# EAGLE design MYATxmega32 (EAGLE 8.4.0)
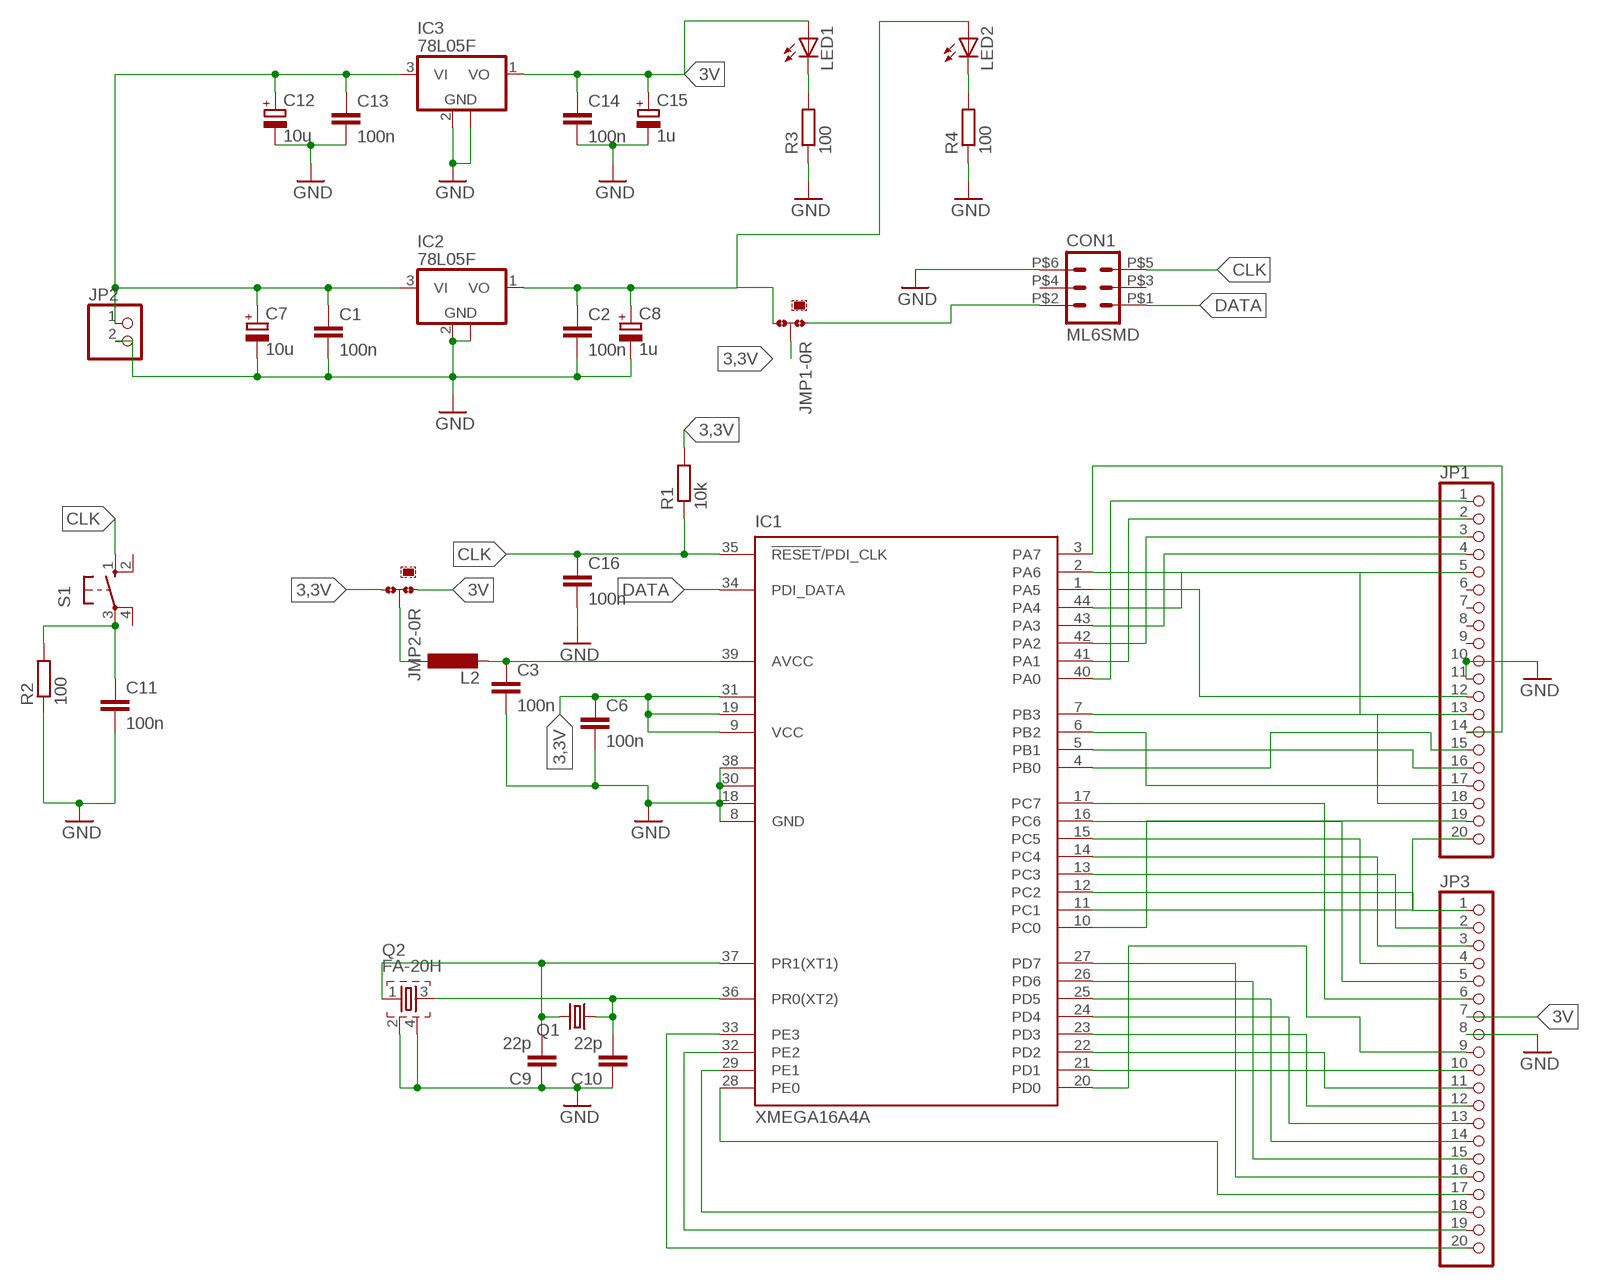
[diagram p0: schematic, sheet 1]

## Parts
C1  100n  C-EUC0805K  [C0805K]
C2  100n  C-EUC0805K  [C0805K]
C3  100n  C-EUC0805K  [C0805K]
C6  100n  C-EUC0805K  [C0805K]
C7  10u  CPOL-EUE2-5  [E2-5]
C8  1u  CPOL-EU153CLV-0405  [153CLV-0405]
C9  22p  C-EUC0805K  [C0805K]
C10  22p  C-EUC0805K  [C0805K]
C11  100n  C-EUC0805K  [C0805K]
C12  10u  CPOL-EUE2-5  [E2-5]
C13  100n  C-EUC0805K  [C0805K]
C14  100n  C-EUC0805K  [C0805K]
C15  1u  CPOL-EU153CLV-0405  [153CLV-0405]
C16  100n  C-EUC0805K  [C0805K]
CON1  ML6SMD  [CON06]
IC1  XMEGA16A4A  [TQFP44]
IC2  78L05F  [SOT89]
IC3  78L05F  [SOT89]
JMP1  0R-JUMPA  [A0R-JMP]
JMP2  0R-JUMPA  [A0R-JMP]
JP1  PINHD-1X20  [1X20]
JP2  PINHD-1X2  [1X02]
JP3  PINHD-1X20  [1X20]
L2  L-EU0207/7  [0207/7]
LED1  LEDSML0805  [SML0805]
LED2  LEDSML0805  [SML0805]
Q1  CRYSTALHC18U-V  [HC18U-V]
Q2  FA-20H  [FA-20H]
R1  10k  R-EU_R0805  [R0805]
R2  100  R-EU_R0805  [R0805]
R3  100  R-EU_R0805  [R0805]
R4  100  R-EU_R0805  [R0805]
S1  10-XX  [B3F-10XX]

## Nets
3,3V: C6.1 IC1.9(VCC) IC1.19(VCC1) IC1.31(VCC2) JMP1.2 JMP2.3 R1.2
3V: C14.1 C15.+ IC3.1(VO) JMP2.1 JP3.7 LED1.A
CLK: C16.1 CON1.P$5 IC1.35(!RESET!/PDI_CLK) R1.1 S1.1(S)
DATA: CON1.P$1 IC1.34(PDI_DATA)
GND: C1.2 C2.2 C3.2 C6.2 C7.- C8.- C9.1 C10.1 C11.2 C12.- C13.2 C14.2 C15.- C16.2 CON1.P$6 IC1.8(GND) IC1.18(GND1) IC1.30(GND2) IC1.38(GND3) IC2.2(GND) IC2.2@1(GND) IC3.2(GND) IC3.2@1(GND) JP1.10 JP1.11 JP2.2 JP3.8 Q2.2 Q2.4 R2.1 R3.1 R4.1
N$1: C2.1 C8.+ IC2.1(VO) JMP1.3 LED2.A
N$2: C1.1 C7.+ C12.+ C13.1 IC2.3(VI) IC3.3(VI) JP2.1
N$3: JMP2.2 L2.1
N$4: C9.2 IC1.37(PR1(XT1)) Q1.2 Q2.1
N$5: C11.1 R2.2 S1.3(P)
N$6: C3.1 IC1.39(AVCC) L2.2
N$7: IC1.3(PA7) JP1.14
N$8: IC1.12(PC2) JP3.1
N$9: IC1.2(PA6) JP1.13
N$10: CON1.P$2 JMP1.1
N$11: IC1.44(PA4) JP1.5
N$12: IC1.43(PA3) JP1.4
N$13: IC1.42(PA2) JP1.3
N$14: IC1.41(PA1) JP1.2
N$15: IC1.13(PC3) JP3.2
N$16: IC1.4(PB0) JP1.15
N$17: IC1.5(PB1) JP1.16
N$18: IC1.6(PB2) JP1.17
N$19: IC1.7(PB3) JP1.18
N$20: IC1.40(PA0) JP1.1
N$21: LED1.C R3.2
N$22: C10.2 IC1.36(PR0(XT2)) Q1.1 Q2.3
N$23: IC1.14(PC4) JP3.3
N$24: IC1.15(PC5) JP3.4
N$25: IC1.16(PC6) JP3.5
N$26: IC1.17(PC7) JP3.6
N$27: IC1.1(PA5) JP1.12
N$28: LED2.C R4.2
N$29: IC1.21(PD1) JP3.10
N$30: IC1.20(PD0) JP3.9
N$31: IC1.22(PD2) JP3.11
N$32: IC1.23(PD3) JP3.12
N$33: IC1.24(PD4) JP3.13
N$34: IC1.25(PD5) JP3.14
N$35: IC1.26(PD6) JP3.15
N$36: IC1.27(PD7) JP3.16
N$37: IC1.28(PE0) JP3.17
N$38: IC1.29(PE1) JP3.18
N$39: IC1.32(PE2) JP3.19
N$40: IC1.33(PE3) JP3.20
N$41: IC1.10(PC0) JP1.19
N$42: IC1.11(PC1) JP1.20
Unconnected: CON1.P$3 CON1.P$4 JP1.6 JP1.7 JP1.8 JP1.9 S1.2(S1) S1.4(P1)

## Library data of the parts
C1-C3 C6 C9-C11 C13 C14 C16 = resistor:C-EU: CAPACITOR, European symbol
C7 C8 C12 C15 = resistor:CPOL-EU: POLARIZED CAPACITOR, European symbol
CON1 = con_harting-smd:ML6SMD; SPICEPREFIX: X
IC1 = atmel:XMEGA16A4: MICROCONTROLLER Features High-performance, Low-power 8/16-bit AVR XMEGA Microcontroller Non-Volatile Program and Data Memories - 16 KB - 128 KB of In-System Self-Programmable Flash - 4 KB - 8 KB Boot Code Section with Independent Lock Bits - 1 KB - 2 KB EEPROM - 2 KB - 8 KB Internal SRAM Peripheral Features - Four-channel DMA Controller with support for external requests - Eight-channel Event System - Five 16-bit Timer/Counters Three Timer/Counters with 4 Output Compare or Input Capture channels Two Timer/Counters with 2 Output Compare or Input Capture channels High-Resolution Extensions on all Timer/Counters Advanced Waveform Extension on one Timer/Counter - Five USARTs IrDA Extension on one USART - Two Two-Wire Interfaces with dual address match (I2C and SMBus compatible) - Two SPIs (Serial Peripheral Interfaces) peripherals - AES and DES Crypto Engine - 16-bit Real Time Counter with Separate Oscillator - One Twelve-channel, 12-bit, 2 Msps Analog to Digital Converter - One Two-channel, 12-bit, 1 Msps Digital to Analog Converter - Two Analog Comparators with Window compare function - External Interrupts on all General Purpose I/O pins - Programmable Watchdog Timer with Separate On-chip Ultra Low Power Oscillator Special Microcontroller Features - Power-on Reset and Programmable Brown-out Detection - Internal and External Clock Options with PLL - Programmable Multi-level Interrupt Controller - Sleep Modes: Idle, Power-down, Standby, Power-save, Extended Standby - Advanced Programming, Test and Debugging Interfaces PDI (Program and Debug Interface) for programming, test and debugging I/O and Packages - 34 Programmable I/O Lines - 44 - lead TQFP - 44 - pad VQFN/QFN - 49 - ball VFBGA Operating Voltage - 1.6 - 3.6V Speed performance - 0 - 12 MHz @ 1.6 - 3.6V - 0 - 32 MHz @ 2.7 - 3.6V Drawn by Dipl.-Ing. (FH) Robert Siegler Created: 27.05.09; OC_FARNELL: unknown; OC_NEWARK: unknown
IC2 IC3 = linear:78L*: POSITOIV-VOLTAGE REGULATORS Output up to 100 mA Source: Datasheet <http://focus.ti.com/lit/ds/symlink/ua78l05.pdf>
JMP1 JMP2 = jump-0r-smd:0R-JUMP: SMD 0R 0805 Jumper
JP1 JP3 = pinhead:PINHD-1X20: PIN HEADER
JP2 = pinhead:PINHD-1X2: PIN HEADER
L2 = resistor:L-EU: INDUCTOR, European symbol
LED1 LED2 = led:LED: LED OSRAM: - CHIPLED LG R971, LG N971, LY N971, LG Q971, LY Q971, LO R971, LY R971 LH N974, LH R974 LS Q976, LO Q976, LY Q976 LO Q996 - Hyper CHIPLED LW Q18S LB Q993, LB Q99A, LB R99A - SideLED LS A670, LO A670, LY A670, LG A670, LP A670 LB A673, LV A673, LT A673, LW A673 LH A674 LY A675 LS A676, LA A676, LO A676, LY A676, LW A676 LS A679, LY A679, LG A679 - Hyper Micro SIDELED® LS Y876, LA Y876, LO Y876, LY Y876 LT Y87S - SmartLED LW L88C, LW L88S LB L89C, LB L89S, LG L890 LS L89K, LO L89K, LY L89K LS L896, LA L896, LO L896, LY L896 - TOPLED LS T670, LO T670, LY T670, LG T670, LP T670 LSG T670, LSP T670, LSY T670, LOP T670, LYG T670 LG T671, LOG T671, LSG T671 LB T673, LV T673, LT T673, LW T673 LH T674 LS T676, LA T676, LO T676, LY T676, LB T676, LH T676, LSB T676, LW T676 LB T67C, LV T67C, LT T67C, LS T67K, LO T67K, LY T67K, LW E67C LS E67B, LA E67B, LO E67B, LY E67B, LB E67C, LV E67C, LT E67C LW T67C LS T679, LY T679, LG T679 LS T770, LO T770, LY T770, LG T770, LP T770 LB T773, LV T773, LT T773, LW T773 LH T774 LS E675, LA E675, LY E675, LS T675 LS T776, LA T776, LO T776, LY T776, LB T776 LHGB T686 LT T68C, LB T68C - Hyper Mini TOPLED® LB M676 - Mini TOPLED Santana® LG M470 LS M47K, LO M47K, LY M47K Source: http://www.osram.convergy.de LUXEON: - LUMILED® LXK2-PW12-R00, LXK2-PW12-S00, LXK2-PW14-U00, LXK2-PW14-V00 LXK2-PM12-R00, LXK2-PM12-S00, LXK2-PM14-U00 LXK2-PE12-Q00, LXK2-PE12-R00, LXK2-PE12-S00, LXK2-PE14-T00, LXK2-PE14-U00 LXK2-PB12-K00, LXK2-PB12-L00, LXK2-PB12-M00, LXK2-PB14-N00, LXK2-PB14-P00, LXK2-PB14-Q00 LXK2-PR12-L00, LXK2-PR12-M00, LXK2-PR14-Q00, LXK2-PR14-R00 LXK2-PD12-Q00, LXK2-PD12-R00, LXK2-PD12-S00 LXK2-PH12-R00, LXK2-PH12-S00 LXK2-PL12-P00, LXK2-PL12-Q00, LXK2-PL12-R00 Source: www.luxeon.com KINGBRIGHT: KA-3528ASYC Source: www.kingbright.com
Q1 = crystal:CRYSTAL: CRYSTAL; OC_FARNELL: unknown; OC_NEWARK: unknown
Q2 = crystal:FA-: MHz RANGE CRYSTAL UNIT Source: Epson Toyocom
R1-R4 = resistor:R-EU_: RESISTOR, European symbol
S1 = switch-omron:10-XX: OMRON SWITCH; MPN: B3F-1000; OC_FARNELL: 176432; OC_NEWARK: 36M3542

## Board
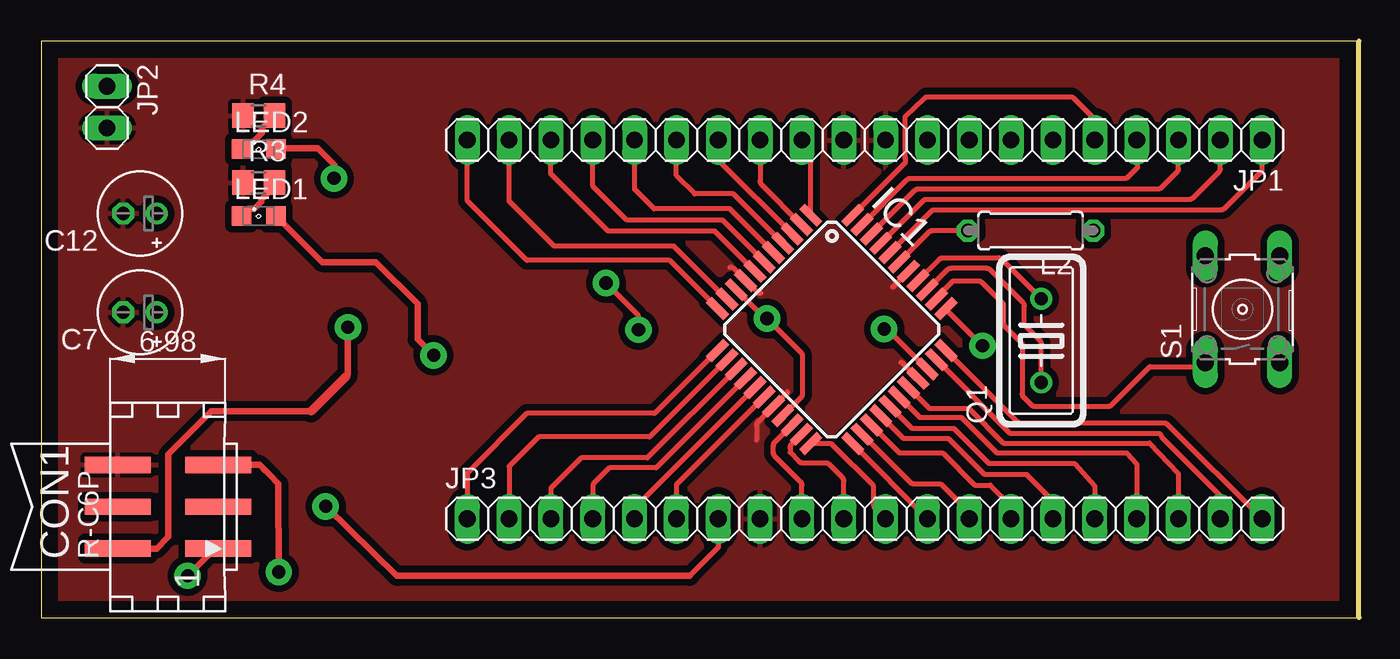
[diagram p1: board, top side]
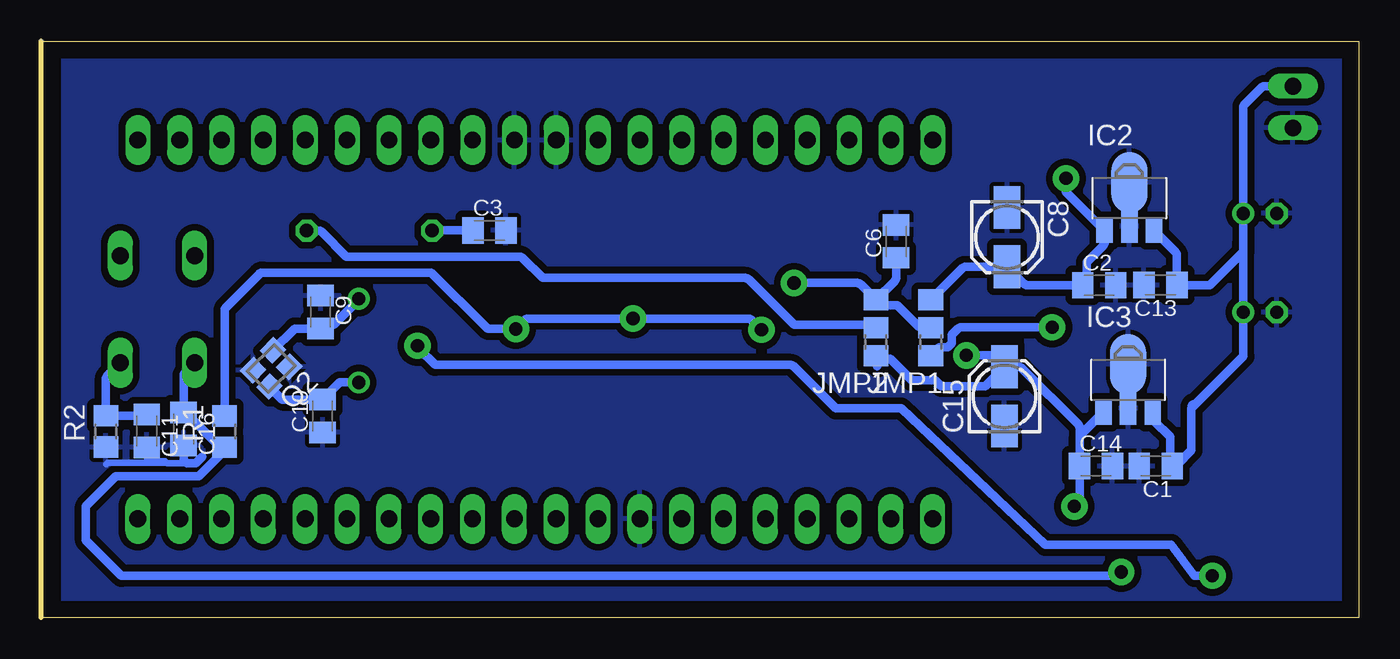
[diagram p2: board, bottom side, seen from below]

Size 80 x 35 mm. Coordinates in mm from the lower left corner, seen from the top.
Outline: 0,0 80,0 80,35 0,35 0,0
Copper layers (1*16): Top 0.035mm / dielectric 1.5mm / Bottom 0.035mm
Design rules "default": minimum track width 6mil, minimum drill 0.35mm, track to track 6mil, track to pad 6mil, pad to pad 6mil, via to via 6mil, smd to smd 6mil, copper to edge 40mil, drill to drill 6mil, minimum pad ring 10mil, minimum via ring 8mil, stop-mask expansion 4mil, vias tented up to drill 0mil, thermal gap 10mil

### Footprints (pad centres in the part's own frame; a part is rotated, then mirrored left to right if it is on the bottom)
C0805K = smd 1.3 x 1.6: 1 -1,0; 2 1,0
E2-5 = drill 0.813 pad 1.27: + -1.016,0 | drill 0.813 pad 1.27 octagon: - 1.016,0
153CLV-0405 = smd 2.6 x 1.6: + 1.8,0; - -1.8,0
CON06 = smd 1 x 4: P$1 -2.54,-3.048; P$2 -2.54,3.048; P$3 0,-3.048; P$4 0,3.048; P$5 2.54,-3.048; P$6 2.54,3.048
TQFP44 = smd 1.5 x 0.5: 1 -5.8,4; 2 -5.8,3.2; 3 -5.8,2.4; 4 -5.8,1.6; 5 -5.8,0.8; 6 -5.8,0; 7 -5.8,-0.8; 8 -5.8,-1.6; 9 -5.8,-2.4; 10 -5.8,-3.2; 11 -5.8,-4; 23 5.8,-4; 24 5.8,-3.2; 25 5.8,-2.4; 26 5.8,-1.6; 27 5.8,-0.8; 28 5.8,0; 29 5.8,0.8; 30 5.8,1.6; 31 5.8,2.4; 32 5.8,3.2; 33 5.8,4 | smd 0.5 x 1.5: 12 -4,-5.8; 13 -3.2,-5.8; 14 -2.4,-5.8; 15 -1.6,-5.8; 16 -0.8,-5.8; 17 0,-5.8; 18 0.8,-5.8; 19 1.6,-5.8; 20 2.4,-5.8; 21 3.2,-5.8; 22 4,-5.8; 34 4,5.8; 35 3.2,5.8; 36 2.4,5.8; 37 1.6,5.8; 38 0.8,5.8; 39 0,5.8; 40 -0.8,5.8; 41 -1.6,5.8; 42 -2.4,5.8; 43 -3.2,5.8; 44 -4,5.8
SOT89 = smd 1 x 1.5: 1 -1.499,-1.981; 3 1.499,-1.981 | smd 1 x 2: 2 0,-1.727 | smd 2.2 x 3.7: 2@1 0,0.94
A0R-JMP = smd 1.5 x 1.3: 1 0,1.7; 2 0,0; 3 0,-1.7
1X20 = drill 1.016 long: 1 -24.13,0; 2 -21.59,0; 3 -19.05,0; 4 -16.51,0; 5 -13.97,0; 6 -11.43,0; 7 -8.89,0; 8 -6.35,0; 9 -3.81,0; 10 -1.27,0; 11 1.27,0; 12 3.81,0; 13 6.35,0; 14 8.89,0; 15 11.43,0; 16 13.97,0; 17 16.51,0; 18 19.05,0; 19 21.59,0; 20 24.13,0
1X02 = drill 1.016 long: 1 -1.27,0; 2 1.27,0
0207/7 = drill 0.813 octagon: 1 -3.81,0; 2 3.81,0
SML0805 = smd 1.2 x 1.2: A 1.05,0; C -1.05,0
HC18U-V = drill 0.813: 1 -2.54,0; 2 2.54,0
FA-20H = smd 1.2 x 1.1: 1 -0.85,-0.7; 2 0.85,-0.7; 3 0.85,0.7; 4 -0.85,0.7
R0805 = smd 1.3 x 1.5: 1 -0.95,0; 2 0.95,0
B3F-10XX = drill 1.016 long: 1 -3.251,2.261; 2 3.251,2.261; 3 -3.251,-2.261; 4 3.251,-2.261

### Placement (x,y rotation side)
C1  12.33,9.2 180 bottom
C2  15.76,20.18 0 bottom
C3  52.78,23.51 0 bottom
C6  28.09,22.85 90 bottom
C7  6,18.54 180 top
C8  21.36,23.1 270 bottom
C9  63.04,18.55 270 bottom
C10  62.92,12.24 90 bottom
C11  73.59,11.33 270 bottom
C12  6,24.54 180 top
C13  12.05,20.19 180 bottom
C14  15.96,9.21 0 bottom
C15  21.51,13.44 90 bottom
C16  71.35,11.45 270 bottom
CON1  7.7,6.73 90 top
IC1  48,17.5 315 top
IC2  13.93,25.48 0 bottom
IC3  14.01,14.45 0 bottom
JMP1  25.99,17.6 180 bottom
JMP2  29.32,17.6 180 bottom
JP1  50,29 180 top
JP2  4,31 270 top
JP3  50,6 0 top
L2  60.07,23.5 180 top
LED1  13.21,24.38 0 top
LED2  13.21,28.45 0 top
Q1  60.72,16.82 90 top
Q2  66.04,15.13 225 bottom
R1  68.86,11.3 90 bottom
R2  76.07,11.31 90 bottom
R3  13.21,26.42 0 top
R4  13.21,30.48 0 top
S1  72.94,18.73 90 top

### Tracks (layer width: path | path; a pad name or v marks a point on that pad's centre or on a via)
3,3V  (via drill 0.8 pad 1.6)
  Top 0.305: IC1.9 43.86,18.25 arc45 v44.07,18.16 46.13,16.09 arc-45 46.23,15.87 46.23,13.6 arc-45 46.13,13.37 IC1.19 | IC1.31 51.46,17.43 arc45 51.24,17.53 v51.18,17.53 | v34.29,20.32 36.18,18.43 arc-45 36.27,18.21 v36.27,17.48
  Bottom 0.508: JMP1.2 26.51,17.6 arc45 26.73,17.69 28.02,18.97 28.86,18.97 arc45 29.09,19.07 JMP2.3 | JMP2.3 28.18,20.44 arc-45 28.09,20.66 C6.1 | R1.2 68.86,18.63 arc45 68.77,18.86 66.77,20.86 arc45 66.54,20.95 56.31,20.95 52.98,17.62 arc-45 52.75,17.53 v51.18,17.53 50.64,18.07 arc45 50.41,18.16 v44.07,18.16 37.09,18.16 arc45 36.86,18.07 v36.27,17.48 | JMP2.3 30.25,20.23 arc-45 30.47,20.32 v34.29,20.32
3V  (via drill 0.8 pad 1.6)
  Top 0.305: JP3.7 41.11,4.28 39.37,2.54
  Top 0.406: v23.82,15.93 22.86,16.89 22.86,19.05 20.32,21.59 17.05,21.59 LED1.A | v17.27,6.76 21.59,2.54 39.37,2.54
  Bottom 0.508: C14.1 arc-45 16.94,9.24 16.94,10.9 arc45 16.85,11.13 IC3.1 | C15.+ 20.68,15.23 arc45 20.45,15.14 17.05,11.74 arc45 16.96,11.52 C14.1 | C15.+ 22.68,14.06 25.34,14.06 25.7,14.43 27.15,14.43 28.45,15.72 29.22,15.72 29.32,15.82 | 29.23,15.26 arc45 29.32,15.48 29.32,15.82 | 29.32,15.82 JMP2.1 | v23.82,15.93 22.2,15.93 C15.+ | v17.27,6.76 16.96,7.17 C14.1
CLK  (via drill 0.8 pad 1.6)
  Top 0.305: IC1.35 arc-45 54.44,19.51 55.37,20.45 56.89,20.45 arc-45 57.12,20.35 58.42,19.05 58.42,17.91 arc45 58.51,17.69 59.56,16.64 59.56,13.59 arc45 59.66,13.37 60.1,12.92 arc45 60.33,12.83 64.77,12.83 arc45 64.99,12.92 67.31,15.24 70.31,15.24 arc45 70.53,15.33 S1.1
  Top 0.406: 13.51,9.02 13.8,8.72 | 13.8,8.72 14.4,8.13 v14.43,2.77 | 13.8,8.72 13.26,9.27 CON1.P$5
  Bottom 0.508: S1.1 71.26,14.89 arc-45 71.35,14.67 C16.1 arc-45 71.13,12.36 69.21,10.44 arc-45 68.98,10.35 R1.1 68.86,10.15 70.43,8.59 75.46,8.59 77.29,6.76 77.29,4.7 75.13,2.54 14.53,2.54 v14.43,2.77
DATA  (via drill 0.8 pad 1.6)
  Top 0.305: v57.15,16.51 54.96,18.7 arc-45 IC1.34
  Top 0.406: v8.89,2.54 10.54,4.19 CON1.P$1
  Bottom 0.508: v57.15,16.51 arc-45 57.08,16.34 56.08,15.34 34.52,15.34 arc45 34.3,15.25 31.75,12.7 27.79,12.7 19.02,4.42 11.38,4.42 9.98,2.54 v8.89,2.54
GND
  Top 0.305: 43.43,10.79 43.43,11.67 arc-45 43.53,11.9 IC1.18 45.31,13.68 45.31,13.72 | IC1.38 51.7,20.07 arc-45 51.69,20.07 | IC1.30 52.32,15.44 arc45 52.2,15.49 | 41.81,21.26 41.98,21.26 IC1.8 43.53,19.71 43.71,19.71
  Bottom 0.406: 73.56,10.3 73.56,9.5 72.47,9.5 | 72.47,9.5 72.36,9.4 75.97,9.4 76.05,9.32 | 72.47,9.5 72.34,9.37 71.12,9.37
  Bottom 0.508: C16.2 71.35,9.55 71.17,9.37 71.12,9.37 70.61,9.37 70.21,9.78 | C11.2 73.56,10.3
  pour Top (isolate 0.406): 79.4,34.5 79.4,0.5 0.6,0.5 0.6,34.4
  pour Bottom (isolate 0.406): 0.9,34 79,34 79,1 0.8,1 0.8,34
N$1  (via drill 0.8 pad 1.6)
  Top 0.406: LED2.A 14.31,28.5 16.79,28.5 17.78,27.51 v17.78,26.67
  Bottom 0.508: JMP1.3 24.08,21.21 arc45 23.86,21.3 C8.+ 20.34,20.28 arc-45 20.11,20.18 C2.1 16.6,20.34 arc-45 16.51,20.57 16.51,21.59 15.52,22.58 arc-45 15.43,22.8 IC2.1 17.78,25.85 v17.78,26.67
N$2
  Bottom 0.508: JP2.1 5.7,32.27 arc-45 5.92,32.18 6.92,31.18 arc-45 7.02,30.95 C12.+ 7.02,22.86 | IC2.3 11.14,22.21 arc45 11.05,21.98 C13.1 9.04,20.19 7.02,22.22 7.02,22.86 | 10.07,12.95 arc-45 10.16,12.72 | 10.16,12.72 10.16,10.16 11.03,9.29 arc45 11.25,9.2 C1.1 11.36,9.23 arc45 11.46,9.46 11.46,10.97 12.42,11.94 arc45 12.51,12.16 IC3.3 | 10.16,12.72 7.02,15.87 C7.+ 7.02,22.86
N$3
  Bottom 0.508: JMP2.2 29.41,17.69 arc-45 29.63,17.78 34.29,17.78 37.04,20.53 arc-45 37.27,20.62 49.55,20.62 50.76,21.83 arc-45 50.98,21.92 61.47,21.92 62.95,23.4 arc-45 63.17,23.5 L2.1
N$4
  Top 0.305: Q1.2 58.33,21.75 arc45 58.11,21.84 54.74,21.84 arc45 54.52,21.75 IC1.37
  Bottom 0.508: Q2.1 64.61,17.55 C9.2 62.81,17.78 62.23,17.78 60.72,19.29 Q1.2
N$5
  Bottom 0.508: C11.1 arc45 73.78,12.26 R2.2 76.07,14.47 arc45 75.98,14.7 S1.3
N$6
  Top 0.305: L2.2 54.13,23.5 arc45 53.9,23.4 IC1.39
  Bottom 0.508: L2.2 arc45 56.22,23.51 C3.1
N$7
  Top 0.305: JP1.14 41.11,27.92 arc45 41.2,27.69 IC1.3
N$8
  Top 0.305: IC1.12 37.24,12.39 29.49,12.39 25.87,8.78 JP3.1
N$9
  Top 0.305: JP1.13 43.65,26.51 arc45 43.74,26.28 IC1.2
N$10  (via drill 0.8 pad 1.6)
  Top 0.406: 18.52,14.66 arc45 18.62,14.89 v18.62,17.63 | 16.38,12.52 10.34,12.52 7.72,9.91 7.72,4.9 7.01,4.19 CON1.P$2
  Top 0.508: 16.38,12.52 18.52,14.66
  Bottom 0.508: 25.87,15.95 arc-45 JMP1.1 25.48,16.41 24.97,16.41 24.71,16.66 24.71,17.17 24.36,17.53 24.36,17.54 arc45 24.13,17.63 v18.62,17.63
N$11
  Top 0.305: 52.48,27.84 52.48,27.94 | 52.48,27.94 52.48,30.45 53.63,31.53 arc-45 53.85,31.62 62.48,31.62 arc-45 62.7,31.53 63.88,30.36 arc-45 63.97,30.13 JP1.5 | 52.48,27.94 52.48,27.63 IC1.44
N$12
  Top 0.305: JP1.4 arc-45 66.55,28.91 66.55,27.3 66.01,26.76 arc-45 65.78,26.67 52.78,26.67 arc45 52.55,26.58 IC1.43
N$13
  Top 0.305: IC1.42 53.05,25.94 arc-45 53.27,26.04 67.81,26.04 arc45 68.04,26.13 68.96,27.05 arc45 69.05,27.27 JP1.3
N$14
  Top 0.305: IC1.41 53.54,25.31 arc-45 53.77,25.4 69.72,25.4 arc45 69.94,25.49 71.5,27.05 arc45 71.59,27.27 JP1.2
N$15
  Top 0.305: IC1.13 36.95,10.97 30.2,10.97 28.41,9.18 JP3.2
N$16
  Top 0.305: IC1.4 42.03,25.73 39.67,25.73 38.57,26.84 JP1.15
N$17
  Top 0.305: IC1.5 41.82,24.82 37.21,24.82 36.03,26 JP1.16
N$18
  Top 0.305: IC1.6 41.37,24.13 35.56,24.13 33.49,26.2 JP1.17
N$19
  Top 0.305: IC1.7 40.9,23.47 34.42,23.47 30.95,26.94 JP1.18
N$20
  Top 0.305: IC1.40 54.04,24.67 arc-45 54.27,24.77 71.62,24.77 arc45 71.85,24.86 74.04,27.05 arc45 74.13,27.27 JP1.1
N$21
  Top 0.406: LED1.C 12.16,24.42 12.56,24.82 12.93,24.82 13.36,25.25 13.36,25.38 14.16,26.17 R3.2
N$22
  Top 0.305: Q1.1 60.72,16.62 arc45 60.63,16.84 59.69,17.78 59.69,18.92 arc45 59.6,19.14 57.62,21.12 arc45 57.4,21.21 55.23,21.21 arc45 55.01,21.12 IC1.36
  Bottom 0.508: Q2.3 65.35,13.24 C10.2 61.88,14.28 Q1.1
N$23
  Top 0.305: IC1.14 36.81,9.7 32.79,9.7 30.95,7.86 JP3.3
N$24
  Top 0.305: IC1.15 37.33,9.09 34.49,9.09 33.49,8.09 JP3.4
N$25
  Top 0.305: IC1.16 36.12,6.75 arc45 36.03,6.53 JP3.5
N$26
  Top 0.305: IC1.17 38.57,8.07 JP3.6
N$27
  Top 0.305: IC1.1 46.73,28.33 arc45 46.63,28.56 JP1.12
N$28
  Top 0.406: LED2.C 12.16,28.48 12.45,28.48 13.39,29.41 13.39,29.71 R4.2
N$29
  Top 0.305: IC1.21 45.56,10.53 arc45 45.47,10.31 45.47,10.03 46.01,9.49 arc45 46.23,9.4 47.62,9.4 arc-45 47.84,9.3 48.26,8.89 | 48.26,8.89 48.51,8.64 | JP3.10 48.73,8.29 arc45 48.64,8.51 48.26,8.89
N$30
  Top 0.305: JP3.9 46.19,8.03 arc45 46.1,8.26 44.54,9.81 arc-45 44.45,10.04 44.45,10.42 arc-45 44.54,10.65 IC1.20
N$31
  Top 0.305: JP3.11 50.64,6.63 arc-45 50.55,6.86 50.55,8 48.07,10.48 arc45 47.84,10.57 IC1.22
N$32
  Top 0.305: JP3.12 49.3,10.51 arc-45 IC1.23
N$33
  Top 0.305: IC1.24 52.75,8.22 arc45 52.98,8.13 54.61,8.13 56.26,6.48 arc-45 56.35,6.26 JP3.13
N$34
  Top 0.305: IC1.25 52.1,10.01 54.74,10.01 56.69,8.05 57.63,8.05 58.89,6.79 JP3.14
N$35
  Top 0.305: IC1.26 52.37,10.87 55.09,10.87 57.28,8.69 59.84,8.69 61.43,7.1 JP3.15
N$36
  Top 0.305: IC1.27 52.89,11.48 55.42,11.48 57.56,9.34 62.74,9.34 | 62.74,9.35 62.74,9.34 | 62.74,9.34 63.97,7.96 JP3.16
N$37
  Top 0.305: IC1.28 53.36,12.14 55.88,12.14 58.04,9.98 65.94,9.98 66.51,9.33 JP3.17
N$38
  Top 0.305: IC1.29 53.93,12.7 56.32,12.7 58.43,10.59 67.28,10.59 69.05,8.72 JP3.18
N$39
  Top 0.305: JP3.19 71.59,7.27 arc45 71.5,7.5 68.04,10.96 arc45 67.89,11.18 59.69,11.18 | 59.69,11.18 59.18,11.18 | 59.69,11.18 58.85,11.18 IC1.32
N$40
  Top 0.305: JP3.20 68.41,11.72 arc45 68.19,11.81 59.48,11.81 arc-45 59.25,11.9 IC1.33
N$41
  Top 0.305: IC1.10 38.42,22.55 31.14,22.55 28.41,25.29 JP1.19
N$42
  Top 0.305: IC1.11 38.15,21.69 29.49,21.69 25.87,25.31 JP1.20